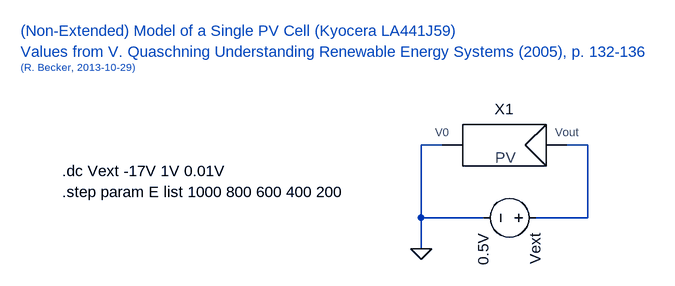
[diagram p0: schematic PVcell_Test.asc]
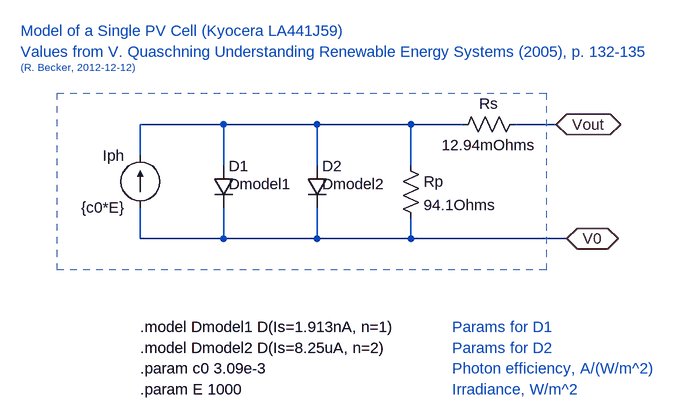
[diagram p1: sub-circuit pvcell.asc]
PVcell_Test.asc, the LTspice schematic file:
Version 4
SHEET 1 1244 680
WIRE 336 64 304 64
WIRE 560 64 528 64
WIRE 304 176 304 64
WIRE 400 176 304 176
WIRE 560 176 560 64
WIRE 560 176 480 176
WIRE 304 224 304 176
FLAG 304 224 0
SYMBOL voltage 496 176 R90
WINDOW 123 0 0 Left 2
WINDOW 39 0 0 Left 2
SYMATTR InstName Vext
SYMATTR Value 0.5V
SYMBOL pvcell 432 64 R0
SYMATTR InstName X1
TEXT -312 -80 Left 2 ;Values from V. Quaschning Understanding Renewable Energy Systems (2005), p. 132-136
TEXT -312 -112 Left 2 ;(Non-Extended) Model of a Single PV Cell (Kyocera LA441J59)
TEXT -312 -56 Left 1 ;(R. Becker, 2013-10-29)
TEXT -248 104 Left 2 !.dc Vext -17V 1V 0.01V
TEXT -248 136 Left 2 !.step param E list 1000 800 600 400 200

pvcell.asc, the sub-circuit schematic file:
Version 4
SHEET 1 880 680
WIRE 0 32 -128 32
WIRE 144 32 0 32
WIRE 288 32 144 32
WIRE 368 32 288 32
WIRE 512 32 448 32
WIRE -128 80 -128 32
WIRE 0 96 0 32
WIRE 144 96 144 32
WIRE 288 96 288 32
WIRE -128 208 -128 160
WIRE 0 208 0 160
WIRE 0 208 -128 208
WIRE 144 208 144 160
WIRE 144 208 0 208
WIRE 288 208 288 176
WIRE 288 208 144 208
WIRE 528 208 288 208
FLAG 512 32 Vout
IOPIN 512 32 BiDir
FLAG 528 208 V0
IOPIN 528 208 BiDir
SYMBOL diode -16 96 R0
WINDOW 3 24 28 Left 2
SYMATTR Value Dmodel1
SYMATTR InstName D1
SYMBOL current -128 160 R180
WINDOW 0 24 80 Left 2
WINDOW 3 24 0 Left 2
SYMATTR InstName Iph
SYMATTR Value {c0*E}
SYMBOL diode 128 96 R0
WINDOW 3 24 28 Left 2
SYMATTR Value Dmodel2
SYMATTR InstName D2
SYMBOL res 272 80 R0
SYMATTR InstName Rp
SYMATTR Value 94.1Ohms
SYMBOL res 464 16 R90
WINDOW 0 0 56 VBottom 2
WINDOW 3 32 56 VTop 2
SYMATTR InstName Rs
SYMATTR Value 12.94mOhms
TEXT -128 344 Left 2 !.model Dmodel1 D(Is=1.913nA, n=1)
TEXT -128 376 Left 2 !.model Dmodel2 D(Is=8.25uA, n=2)
TEXT -128 408 Left 2 !.param c0 3.09e-3
TEXT -312 -80 Left 2 ;Values from V. Quaschning Understanding Renewable Energy Systems (2005), p. 132-135
TEXT -312 -112 Left 2 ;Model of a Single PV Cell (Kyocera LA441J59)
TEXT -312 -56 Left 1 ;(R. Becker, 2012-12-12)
TEXT -128 440 Left 2 !.param E 1000
TEXT 352 440 Left 2 ;Irradiance, W/m^2
TEXT 352 408 Left 2 ;Photon efficiency, A/(W/m^2)
TEXT 352 344 Left 2 ;Params for D1
TEXT 352 376 Left 2 ;Params for D2
RECTANGLE Normal 496 256 -256 -16 1

The netlist it stands for:
* PVcell_Test.asc
Vext N001 0 0.5V
XX1 0 N001 pvcell

* block symbol definitions
.subckt pvcell V0 Vout
D1 N001 V0 Dmodel1
Iph V0 N001 {c0*E}
D2 N001 V0 Dmodel2
Rp N001 V0 94.1Ohms
Rs Vout N001 12.94mOhms
.model Dmodel1 D(Is=1.913nA, n=1)
.model Dmodel2 D(Is=8.25uA, n=2)
.param c0 3.09e-3
* Values from V. Quaschning Understanding Renewable Energy Systems (2005), p. 132-135
* Model of a Single PV Cell (Kyocera LA441J59)
* (R. Becker, 2012-12-12)
.param E 1000
* Irradiance, W/m^2
* Photon efficiency, A/(W/m^2)
* Params for D1
* Params for D2
.ends pvcell

.model D D
.lib standard.dio
* Values from V. Quaschning Understanding Renewable Energy Systems (2005), p. 132-136
* (Non-Extended) Model of a Single PV Cell (Kyocera LA441J59)
* (R. Becker, 2013-10-29)
.dc Vext -17V 1V 0.01V
.step param E list 1000 800 600 400 200
.backanno
.end